# EAGLE design BackupPowerSupply (EAGLE 6.6.0)
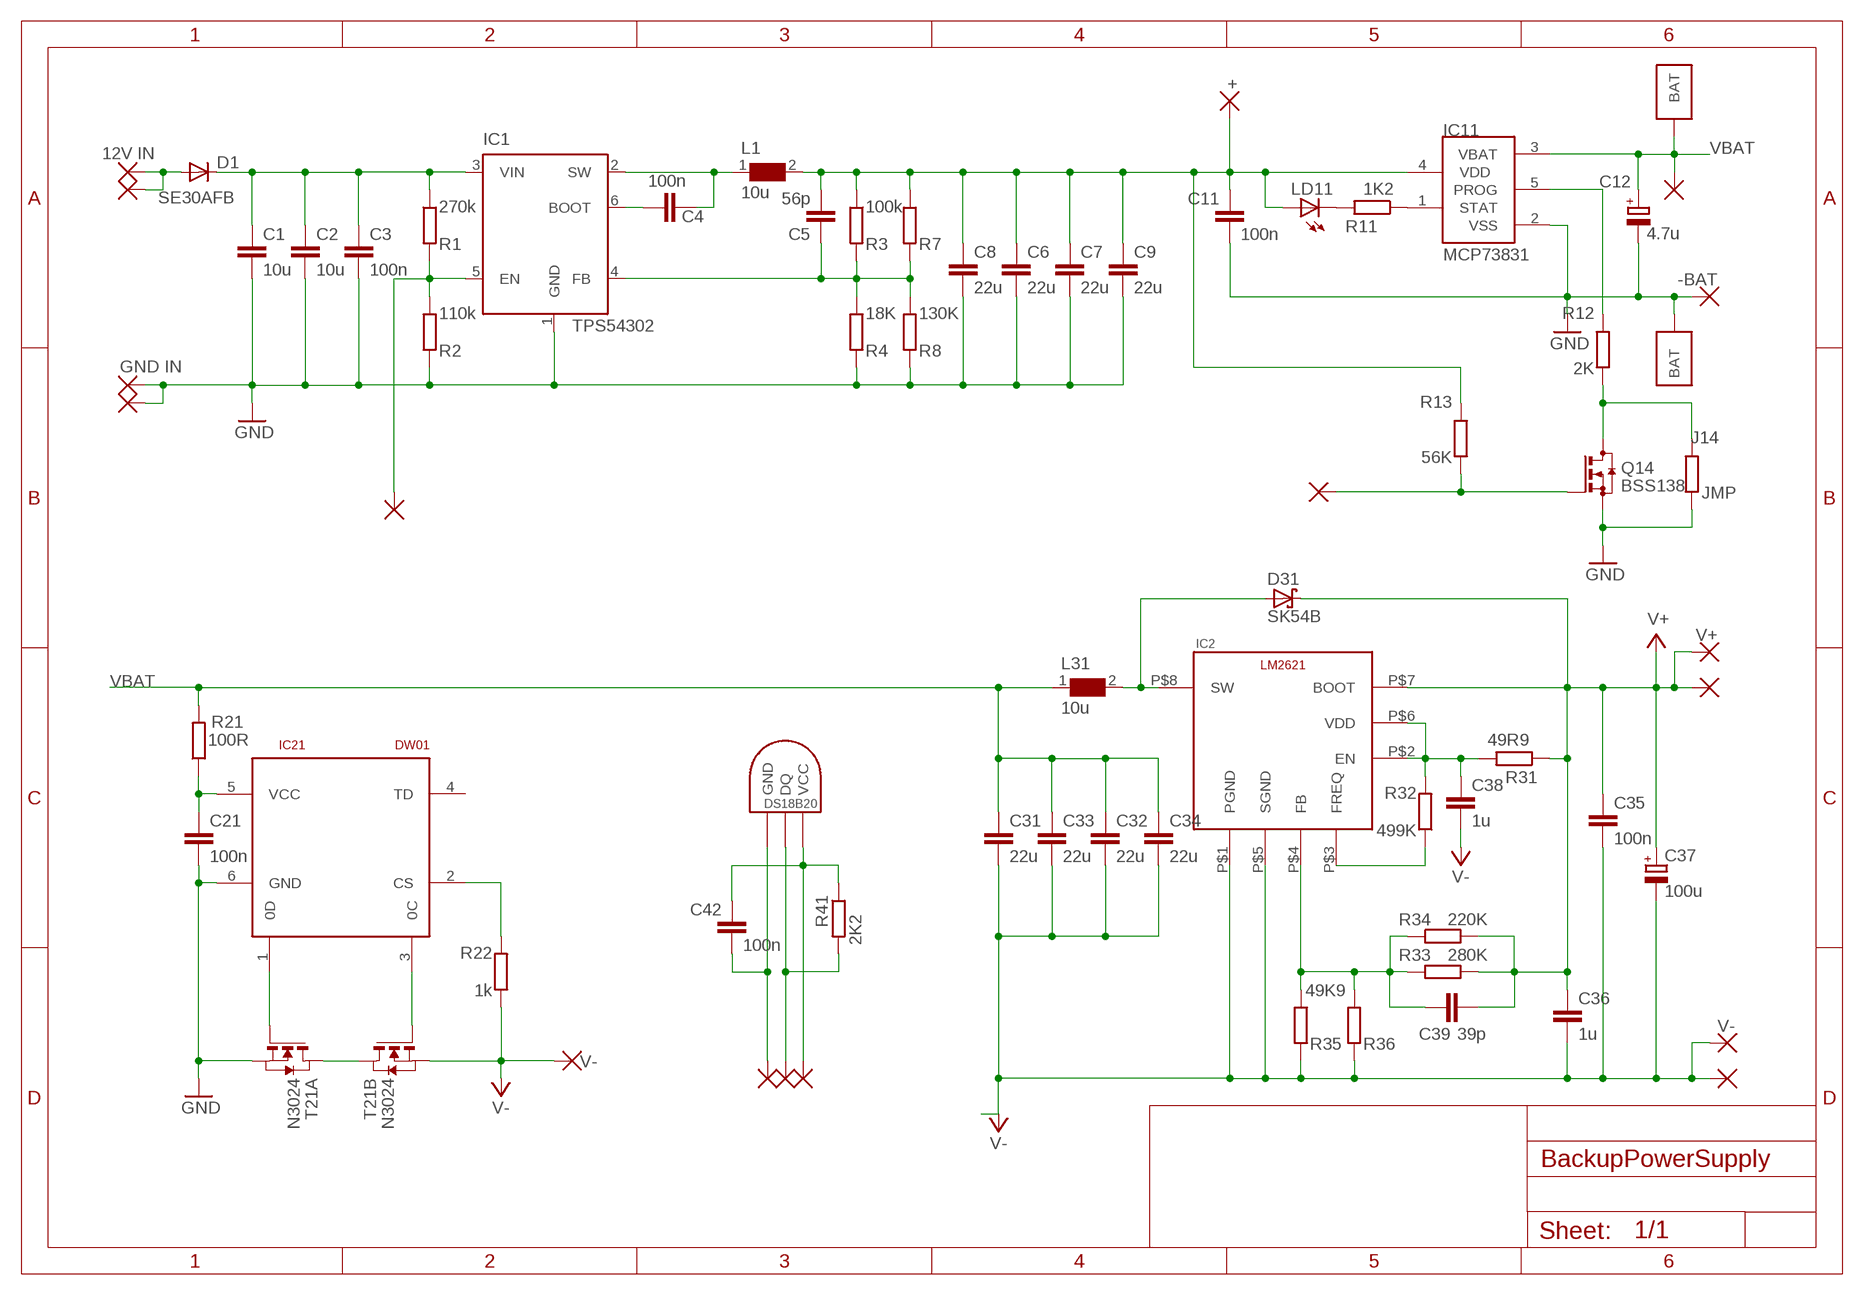
[diagram p0: schematic, sheet 1]

## Parts
C1  10u  C-EUC1206  [C1206]
C2  10u  C-EUC1206  [C1206]
C3  100n  C-EUC1206  [C1206]
C4  100n  C-EUC0805  [C0805]
C5  56p  C-EUC0805  [C0805]
C6  22u  C-EUC0805  [C0805]
C7  22u  C-EUC0805  [C0805]
C8  22u  C-EUC0805  [C0805]
C9  22u  C-EUC0805  [C0805]
C11  100n  C-EUC0805  [C0805]
C12  4.7u  CPOL-EUSMCA  [SMC_A]
C21  100n  C-EUC0805  [C0805]
C31  22u  C-EUC0805  [C0805]
C32  22u  C-EUC0805  [C0805]
C33  22u  C-EUC0805  [C0805]
C34  22u  C-EUC0805  [C0805]
C35  100n  C-EUC0805  [C0805]
C36  1u  C-EUC0805  [C0805]
C37  100u  CPOL-EUSMCB  [SMC_B]
C38  1u  C-EUC0805  [C0805]
C39  39p  C-EUC0805  [C0805]
C42  100n  C-EUC0603  [C0603]
D1  SE30AFB  CGRM4001-G  [SOD-123_MINI-SMA]
D31  SK54B  SCHOTTKY-DIODESMD  [SMB]
DS18B20  DS1820SOIC  [DS18B20_SOIC]
IC1  TPS54302  [TSOT23-6_DDC]
IC2  LM2621VSSOP8  [VSSOP8]
IC11  MCP73831  [SOT23-5L]
IC21  DW01  [SOT23-6]
J14  JMP  R-EU_R0201  [R0201]
L1  10u  WE-LQS_8040  [WE-LQS_8040]
L31  10u  WE-LQS_8040  [WE-LQS_8040]
LD11  LEDCHIPLED_0805  [CHIPLED_0805]
PAD1  +BAT  PAD  [PAD]
PAD2  -BAT  PAD  [PAD]
PAD3  12V IN  PAD  [PAD]
PAD4  GND IN  PAD  [PAD]
PAD5  V+  PAD  [PAD]
PAD6  V-  PAD  [PAD]
PAD7  +  PAD  [PAD]
PAD8  PAD  [PAD]
PAD9  V-  PAD  [PAD]
PAD11  V-  PAD  [PAD]
PAD12  V+  PAD  [PAD]
PAD13  +  PAD  [PAD]
PAD19  V-  PAD  [PAD]
PAD20  V-  PAD  [PAD]
PAD21  V-  PAD  [PAD]
PAD22  PAD  [PAD]
Q14  BSS138  BSS123  [SOT23]
R1  270k  R-EU_M0805  [M0805]
R2  110k  R-EU_M0805  [M0805]
R3  100k  R-EU_M0805  [M0805]
R4  18K  R-EU_M0805  [M0805]
R7  R-EU_M0805  [M0805]
R8  130K  R-EU_M0805  [M0805]
R11  1K2  R-EU_M0805  [M0805]
R12  2K  R-EU_M0805  [M0805]
R13  56K  R-EU_M0805  [M0805]
R21  100R  R-EU_M0805  [M0805]
R22  1k  R-EU_M0805  [M0805]
R31  49R9  R-EU_M0805  [M0805]
R32  499K  R-EU_M0805  [M0805]
R33  280K  R-EU_M0805  [M0805]
R34  220K  R-EU_M0805  [M0805]
R35  49K9  R-EU_M0805  [M0805]
R36  R-EU_M0805  [M0805]
R41  2K2  R-EU_R0603  [R0603]
T21  N3024  DMN3024LSD  [TSSOP-8]
U$1  BAT_A  [BAT_A]
U$2  BAT_A  [BAT_A]
U$3  PAD  [PAD]

## Nets
C6: C5.2 IC1.4(FB) R3.2 R4.1 R7.2 R8.1
FB2: C39.1 IC2.P$4(FB) R33.1 R34.1 R35.1 R36.1
GND: C1.1 C2.1 C3.1 C6.1 C7.1 C8.1 C9.1 C11.1 C12.- C21.1 IC1.1(GND) IC11.2(VSS) IC21.6(GND) J14.1 PAD2.P$1 PAD4.P$1 PAD8.P$1 Q14.2(S) R2.2 R4.2 R8.2 T21.2(A:S) T21.3(A:S) U$2.P$1(BAT) U$2.P$4(BAT)
N$1: C4.2 IC1.6(BOOT)
N$2: C42.1 DS18B20.GND PAD21.P$1
N$3: PAD7.P$1 Q14.1(G) R13.1
N$4: J14.2 Q14.3(D) R12.1
N$5: C5.1 C6.2 C7.2 C8.2 C9.2 C11.2 IC11.4(VDD) L1.2 LD11.A PAD13.P$1 R3.1 R7.1 R13.2
N$6: IC11.1(STAT) R11.1
N$7: IC1.5(EN) PAD22.P$1 R1.2 R2.1
N$8: D1.A PAD3.P$1 U$3.P$1
N$9: IC11.5(PROG) R12.2
N$10: IC21.3(0C) T21.5(B:G)
N$11: LD11.C R11.2
N$13: IC21.1(0D) T21.4(A:G)
N$14: C38.2 IC2.P$2(EN) IC2.P$6(VDD) R31.2 R32.2
N$15: IC2.P$3(FREQ) R32.1
N$17: T21.1(A:D) T21.8(B:D)
N$18: IC21.2(CS) R22.2
N$19: DS18B20.DQ PAD19.P$1 R41.2
N$20: C21.2 IC21.5(VCC) R21.1
N$21: C42.2 DS18B20.VCC PAD20.P$1 R41.1
OUT_DOWN: C4.1 IC1.2(SW) L1.1
V+: C35.2 C36.2 C37.+ C39.2 D31.C IC2.P$7(BOOT) PAD5.P$1 PAD12.P$1 R31.1 R33.2 R34.2
V-: C31.1 C32.1 C33.1 C34.1 C35.1 C36.1 C37.- C38.1 IC2.P$1(PGND) IC2.P$5(SGND) PAD6.P$1 PAD9.P$1 PAD11.P$1 R22.1 R35.2 R36.2 T21.6(B:S) T21.7(B:S)
VBAT: C12.+ C31.2 C32.2 C33.2 C34.2 IC11.3(VBAT) L31.1 PAD1.P$1 R21.2 U$1.P$1(BAT) U$1.P$4(BAT)
VIN_DOWN: C1.2 C2.2 C3.2 D1.C IC1.3(VIN) R1.1
VSW: D31.A IC2.P$8(SW) L31.2
Unconnected: IC21.4(TD)

## Library data of the parts
C1-C9 C11 C21 C31-C36 C38 C39 C42 = rcl:C-EU: CAPACITOR, European symbol
C12 C37 = rcl:CPOL-EU: POLARIZED CAPACITOR, European symbol
D1 = diode:CGRM400*-G: Molded plasitc,JEDEC SOD-123/Mini SMA Source: Comchip CGRM4001-G.pdf
D31 = diode:SCHOTTKY-DIODE: Schottky Diode
DS18B20 = Ava:DS1820: DS18B20 Programmable Resolution 1-Wire Digital Thermometer Description The DS18B20 digital thermometer provides 9-bit to 12-bit Celsius temperature measurements and has an alarm function with nonvolatile user-programmable upper and lower trigger points. The DS18B20 communicates over a 1-Wire® bus that by definition requires only one data line (and ground) for communication with a central microprocessor. It has an operating temperature range of -55°C to +125°C and is accurate to ±0.5°C over the range of -10°C to +85°C. In addition, the DS18B20 can derive power directly from the data line ("parasite power"), eliminating the need for an external power supply. Each DS18B20 has a unique 64-bit serial code, which allows multiple DS18B20s to function on the same 1-Wire bus. Thus, it is simple to use one microprocessor to control many DS18B20s distributed over a large area. Applications that can benefit from this feature include HVAC environmental controls, temperature monitoring systems inside buildings, equipment, or machinery, and process monitoring and control systems.
IC1 = tps54302:TPS54302: Single Voltage Detector Source: http://focus.ti.com/lit/ds/symlink/tps3803-01.pdf
IC2 = lm2621:LM2621
IC11 = microchip-update-2:MCP73831: Miniature Single-Cell, Fully Integrated Li-Ion, Li-Polymer Charge Management Controllers
IC21 = DW01:DW01: The DW01-P battery protection IC is designed to protect lithium-ion/polymer battery from damage or degrading the lifetime due to overcharge, overdischarge, and/or overcurrent for one-cell lithium-ion/polymer battery powered systems, such as cellular phones. Data sheet <http://goo.gl/4y108d> Dave.Calaway Eagle Library <https://goo.gl/Muy1Tr>
J14 R1-R4 R7 R8 R11-R13 R21 R22 R31-R36 R41 = rcl:R-EU_: RESISTOR, European symbol
L1 L31 = Wurth_Elektronik_Passive_rev15b:WE-LQS_8040: SMD Shielded Tiny Power Inductor -Tiny Power Inductor design -1.7 times more current in comparison with unshielded versions - Robust design& high durability -Low RDC -Magnetically shielded wth magneticc glue reducing buzz noise in ultra-low levels -Operating Temperature:-40°C to +125°C -- Intergrated DC/DC Converters --Switching controllers which required high effiiciency --Portable power(Smartphones,digital cameras,Tablets,etc) --Embedded laptops and PCs --Big sizes(5040,60xx,8040) used for shock-proof circiuts <http://katalog.we-online.de/media/images/eisos/IndLQS_pf2.jpg> Details see: http://katalog.we-online.de/en/pbs/WE-LQS Created by Dan Xu 2014-05-21 2014 (C) Würth Elektronik
LD11 = led:LED: LED OSRAM: - CHIPLED LG R971, LG N971, LY N971, LG Q971, LY Q971, LO R971, LY R971 LH N974, LH R974 LS Q976, LO Q976, LY Q976 LO Q996 - Hyper CHIPLED LW Q18S LB Q993, LB Q99A, LB R99A - SideLED LS A670, LO A670, LY A670, LG A670, LP A670 LB A673, LV A673, LT A673, LW A673 LH A674 LY A675 LS A676, LA A676, LO A676, LY A676, LW A676 LS A679, LY A679, LG A679 - Hyper Micro SIDELED® LS Y876, LA Y876, LO Y876, LY Y876 LT Y87S - SmartLED LW L88C, LW L88S LB L89C, LB L89S, LG L890 LS L89K, LO L89K, LY L89K LS L896, LA L896, LO L896, LY L896 - TOPLED LS T670, LO T670, LY T670, LG T670, LP T670 LSG T670, LSP T670, LSY T670, LOP T670, LYG T670 LG T671, LOG T671, LSG T671 LB T673, LV T673, LT T673, LW T673 LH T674 LS T676, LA T676, LO T676, LY T676, LB T676, LH T676, LSB T676, LW T676 LB T67C, LV T67C, LT T67C, LS T67K, LO T67K, LY T67K, LW E67C LS E67B, LA E67B, LO E67B, LY E67B, LB E67C, LV E67C, LT E67C LW T67C LS T679, LY T679, LG T679 LS T770, LO T770, LY T770, LG T770, LP T770 LB T773, LV T773, LT T773, LW T773 LH T774 LS E675, LA E675, LY E675, LS T675 LS T776, LA T776, LO T776, LY T776, LB T776 LHGB T686 LT T68C, LB T68C - Hyper Mini TOPLED® LB M676 - Mini TOPLED Santana® LG M470 LS M47K, LO M47K, LY M47K Source: http://www.osram.convergy.de LUXEON: - LUMILED® LXK2-PW12-R00, LXK2-PW12-S00, LXK2-PW14-U00, LXK2-PW14-V00 LXK2-PM12-R00, LXK2-PM12-S00, LXK2-PM14-U00 LXK2-PE12-Q00, LXK2-PE12-R00, LXK2-PE12-S00, LXK2-PE14-T00, LXK2-PE14-U00 LXK2-PB12-K00, LXK2-PB12-L00, LXK2-PB12-M00, LXK2-PB14-N00, LXK2-PB14-P00, LXK2-PB14-Q00 LXK2-PR12-L00, LXK2-PR12-M00, LXK2-PR14-Q00, LXK2-PR14-R00 LXK2-PD12-Q00, LXK2-PD12-R00, LXK2-PD12-S00 LXK2-PH12-R00, LXK2-PH12-S00 LXK2-PL12-P00, LXK2-PL12-Q00, LXK2-PL12-R00 Source: www.luxeon.com KINGBRIGHT: KA-3528ASYC Source: www.kingbright.com
PAD1-PAD9 PAD11-PAD13 PAD19-PAD22 U$3 = Battery_Clips:PAD
Q14 = transistor-small-signal:BSS123: N-CHANNEL MOS FET
T21 = FS8205A:DMN3024LSD: DUAL N-CHANNEL ENHANCEMENT MODE MOSFET data sheet <http://goo.gl/dRgboR> Dave.Calaway Eagle Library <https://goo.gl/Muy1Tr>
U$1 U$2 = Battery_Clips:BAT_A

## Board
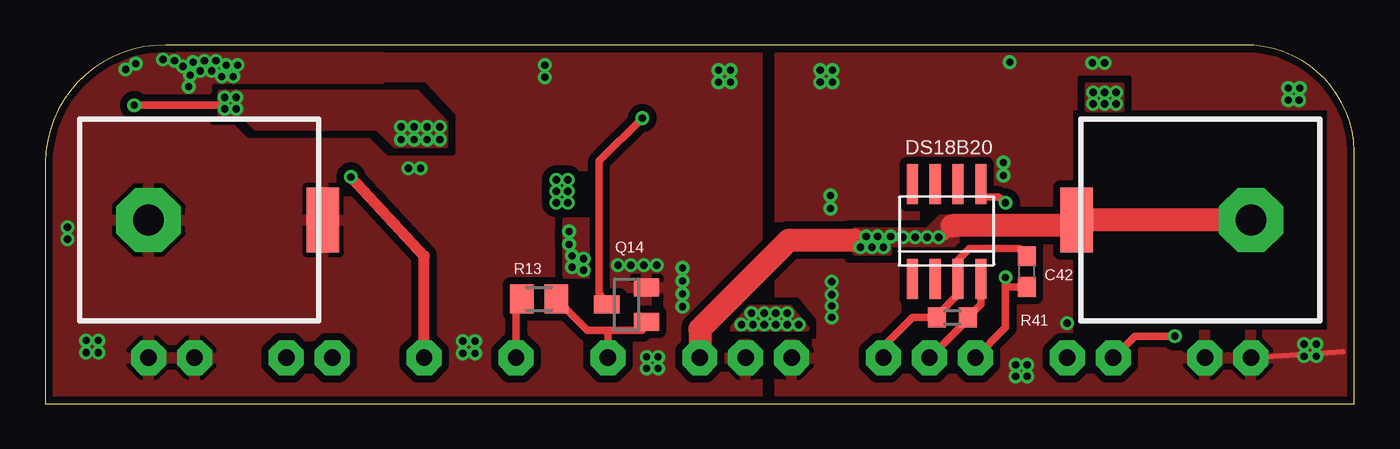
[diagram p1: board, top side]
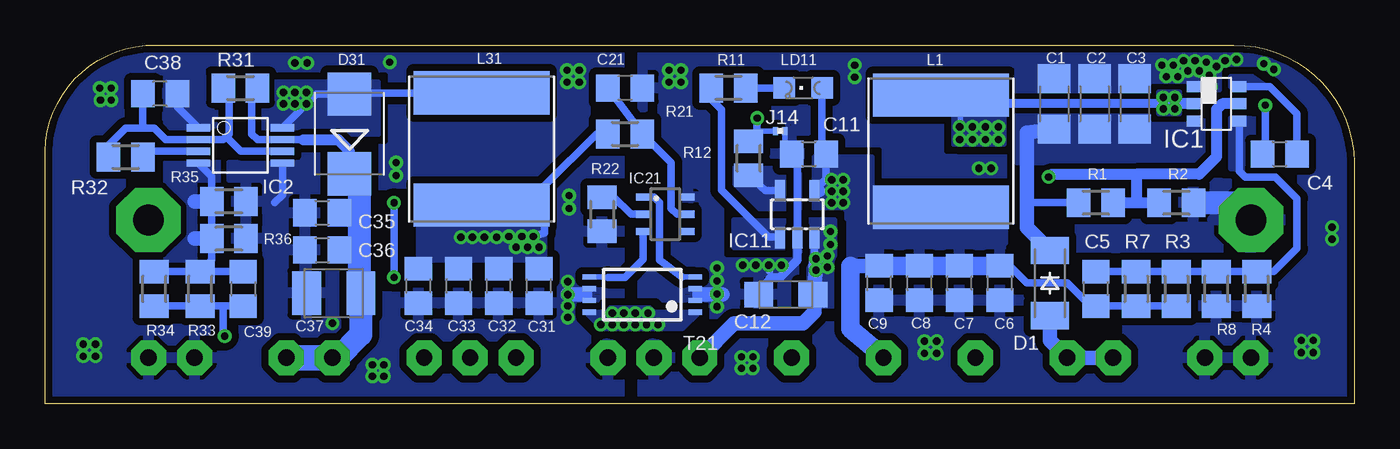
[diagram p2: board, bottom side, seen from below]

Size 72.39 x 19.83 mm. Coordinates in mm from the lower left corner, seen from the top.
Outline: 0,0 72.38,0 72.39,13.97 arc90 66.29,19.83 6.66,19.83 arc90 0,13.34 0,0
Copper layers (1*16): Top 0.0356mm / dielectric 1.5011mm / Bottom 0.0356mm
Design rules "oshpark-2layer_new": minimum track width 6mil, minimum drill 13mil, track to track 6mil, track to pad 6mil, pad to pad 6mil, via to via 6mil, smd to smd 6mil, copper to edge 15mil, drill to drill 6mil, minimum pad ring 7mil, minimum via ring 7mil, stop-mask expansion 2.5mil, vias tented up to drill 0mil, thermal gap 10mil

### Footprints (pad centres in the part's own frame; a part is rotated, then mirrored left to right if it is on the bottom)
C1206 = smd 1.6 x 1.8: 1 -1.4,0; 2 1.4,0
C0805 = smd 1.3 x 1.5: 1 -0.95,0; 2 0.95,0
SMC_A = smd 1.6 x 1.4: + -1.5,0; - 1.5,0
SMC_B = smd 1.6 x 2.4: + -1.5,0; - 1.5,0
C0603 = smd 1.1 x 1: 1 -0.85,0; 2 0.85,0
SOD-123_MINI-SMA = smd 1.5 x 2.1: A 1.8,0; C -1.8,0
SMB = smd 2.4 x 2.4: A 2.2,0; C -2.2,0
DS18B20_SOIC = smd 0.61 x 2.21: DQ 1.905,-2.616; GND 1.905,2.616; NC -1.905,-2.616; NC2 -0.635,-2.616; NC3 -1.905,2.616; NC4 -0.635,2.616; NC5 0.635,2.616; VCC 0.635,-2.616
TSOT23-6_DDC = smd 0.6 x 0.8: 1 -0.95,-1.25; 2 0,-1.25; 3 0.95,-1.25; 4 0.95,1.25; 5 0,1.25; 6 -0.95,1.25
VSSOP8 = smd 0.406 x 1.3: P$1 -0.975,-2.327; P$2 -0.325,-2.327; P$3 0.325,-2.327; P$4 0.975,-2.327; P$5 0.975,2.327; P$6 0.325,2.327; P$7 -0.325,2.327; P$8 -0.975,2.327
SOT23-5L = smd 0.55 x 1.2: 1 -0.95,-1.3; 2 0,-1.3; 3 0.95,-1.3; 4 0.95,1.3; 5 -0.95,1.3
SOT23-6 = smd 0.4 x 0.762: 1 -0.95,-1.245; 2 0,-1.245; 3 0.95,-1.245; 4 0.95,1.245; 5 0,1.245; 6 -0.95,1.245
R0201 = smd 0.28 x 0.43: 1 -0.255,0; 2 0.255,0
WE-LQS_8040 = smd 2.4 x 7.5: 1 -3.1,0; 2 3.1,0
CHIPLED_0805 = smd 1.2 x 1.2: A 0,-1.05; C 0,1.05
PAD = drill 0.9 pad 1.93 octagon: P$1 0,0
SOT23 = smd 1 x 1.4: 1 -0.95,-1.1; 2 0.95,-1.1; 3 0,1.1
M0805 = smd 1.3 x 1.6: 1 -0.95,0; 2 0.95,0
R0603 = smd 1 x 1.1: 1 -0.85,0; 2 0.85,0
TSSOP-8 = smd 0.3 x 0.75: 1 -0.975,-2.925; 2 -0.325,-2.925; 3 0.325,-2.925; 4 0.975,-2.925; 5 0.975,2.925; 6 0.325,2.925; 7 -0.325,2.925; 8 -0.975,2.925
BAT_A = drill 1.7 pad 3.556 octagon: P$1 0,0 | smd 1.8 x 3.6: P$4 -9.652,0

### Placement (x,y rotation side)
C1  16.59,16.59 270 bottom
C2  14.37,16.59 270 bottom
C3  12.14,16.59 270 bottom
C4  4.13,13.81 0 bottom
C5  14.29,6.35 90 bottom
C6  19.61,6.67 90 bottom
C7  21.83,6.67 90 bottom
C8  24.05,6.67 90 bottom
C9  26.27,6.67 90 bottom
C11  30.16,13.81 0 bottom
C12  31.43,6.03 180 bottom
C21  40.32,17.46 180 bottom
C31  45.09,6.51 90 bottom
C32  47.31,6.51 90 bottom
C33  49.53,6.51 90 bottom
C34  51.75,6.51 90 bottom
C35  57.07,10.56 0 bottom
C36  57.07,8.49 0 bottom
C37  56.44,6.11 180 bottom
C38  66.04,17.14 180 bottom
C39  61.44,6.35 270 bottom
C42  54.29,7.3 90 top
D1  16.83,6.67 270 bottom
D31  55.56,14.92 90 bottom
DS18B20  49.85,9.53 0 top
IC1  7.62,16.59 270 bottom
IC2  61.59,14.29 270 bottom
IC11  30.8,10.48 0 bottom
IC21  38.1,10.48 270 bottom
J14  31.75,15.08 180 bottom
L1  22.86,13.97 270 bottom
L31  48.26,14.09 90 bottom
LD11  30.48,17.46 90 bottom
PAD1  36.2,2.54 0 top
PAD2  38.73,2.54 0 top
PAD3  13.34,2.54 180 top
PAD4  5.71,2.54 0 top
PAD5  59.05,2.54 0 top
PAD6  66.67,2.54 0 top
PAD7  31.11,2.54 0 top
PAD8  8.26,2.54 0 top
PAD9  41.27,2.54 0 top
PAD11  64.14,2.54 0 top
PAD12  56.52,2.54 0 top
PAD13  26.04,2.54 0 top
PAD19  48.9,2.54 0 top
PAD20  46.35,2.54 0 top
PAD21  51.44,2.54 0 top
PAD22  20.95,2.54 0 top
Q14  32.15,5.48 90 top
R1  14.29,11.11 0 bottom
R2  9.84,11.11 0 bottom
R3  9.84,6.35 90 bottom
R4  5.4,6.35 270 bottom
R7  12.06,6.35 90 bottom
R8  7.62,6.35 270 bottom
R11  34.61,17.46 0 bottom
R12  33.5,13.57 270 bottom
R13  27.3,5.79 180 top
R21  40.32,14.92 180 bottom
R22  41.59,10.48 90 bottom
R31  61.59,17.46 180 bottom
R32  67.94,13.65 180 bottom
R33  63.82,6.35 270 bottom
R34  66.36,6.35 270 bottom
R35  62.23,11.19 0 bottom
R36  62.23,9.13 0 bottom
R41  50.16,4.76 0 top
T21  39.37,6.03 90 bottom
U$1  66.67,10.16 0 top
U$2  5.71,10.16 180 top
U$3  15.88,2.54 0 top

### Tracks (layer width: path | path; a pad name or v marks a point on that pad's centre or on a via)
C6
  Bottom 0.406: IC1.4 6.35,15.62 6.35,12.86 6.03,12.54 4.37,12.54 3.17,11.35 3.17,8.57 4.45,7.3 6.67,7.3 R4.1 R8.1 R3.2 R7.2 C5.2
  pour Bottom (isolate 0.305, rank 2, no thermals): 6.83,15.8 3.33,15.72 3.33,13.02 6.83,13.02
FB2
  Bottom 0.406: R33.1 C39.1 | R34.1 R33.1 | R33.1 63.18,7.94 R36.1 63.18,9.84 R35.1 63.18,12.57 IC2.P$4
  Bottom 0.813: 64.14,11.19 R35.1 | 64.14,9.13 R36.1
  pour Bottom (isolate 0.305, rank 2, no thermals): 62.55,13.34 65.72,13.34 65.72,7.94 64.14,7.94 64.14,12.38 62.55,12.38
GND  (via drill 0.4)
  Bottom 0.305: T21.2 T21.3 36.2,6.36 36.2,6.03 | 32.38,7.3 32.3,7.3 | J14.1 31.5,13.65 C11.1
  Bottom 0.406: IC11.2 30.8,13.5 C11.1
  Bottom 0.457: IC11.2 30.8,7.94 31.75,6.99 32.3,6.99 C12.-
  Bottom 0.813: 34.92,6.03 36.2,6.03
  Bottom 1.27: R2.2 6.67,11.11 U$2.P$1
  other vias: 2.26,2.82 2.26,3.49 20.08,13.02 20.76,13.02 27.62,18.73 27.62,18.06 37.23,18.45 37.23,17.78 35.24,6.79 37.9,18.45 37.9,17.78 2.94,3.49 2.94,2.82 23.1,3.45 23.77,3.45 23.1,2.78 23.77,2.78 1.23,9.09 1.23,9.76 35.24,7.5 35.24,6.07 35.24,5.36 7.94,17.54 8.02,18.18 8.57,18.41 9.21,18.41 9.45,18.97 7.62,18.65 10.4,18.1 8.81,18.97 8.18,18.89 9.76,18.1 10,18.73 10.64,18.73 7.14,18.97 6.51,19.05 5,18.81 4.45,18.49 31.67,7.66 32.38,7.66 33.1,7.66 33.81,7.66 33.26,2.58 33.89,2.58 33.26,1.94 33.89,1.94
  pour Bottom (isolate 0.406, rank 6): 0.32,19.37 39.37,19.37 39.37,0.32 0.32,0.32
  pour Top (isolate 0.406, rank 6): 0.32,19.37 39.37,19.37 39.37,0.32 0.32,0.32
  pour Bottom (isolate 0.305, rank 2, no thermals): 18.65,17.14 18.65,19.29 7.46,19.29 7.46,17.38 9.21,17.38 9.6,17.54 10.95,17.54 11.35,17.14
  pour Top (isolate 0.305, rank 2, no thermals): 18.57,17.3 18.57,19.45 7.38,19.45 7.38,17.3 9.13,17.3 9.53,17.7 10.87,17.7 11.27,17.3
N$1
  Bottom 0.406: C4.2 3.17,16.03 4.68,17.54 IC1.6
  pour Bottom (isolate 0.305, rank 2, no thermals): 6.83,17.54 6.83,18.1 5.64,18.1 4.84,17.54
N$2  (via drill 0.4)
  Top 0.406: v53.1,6.99 53.1,6.35 | 53.1,6.35 53.1,4.21 PAD21.P$1 | C42.1 53.12,6.45 53.1,6.35 | v53.1,11.11 52.7,11.43 51.75,11.43 DS18B20.GND
  Bottom 0.406: v53.1,11.11 v53.1,6.99
N$3
  Top 0.406: R13.1 30,4.05 30.96,4.05 | 30.96,4.05 33.01,4.05 Q14.1 | PAD7.P$1 31.11,3.89 30.96,4.05
N$4  (via drill 0.4)
  Top 0.406: Q14.3 30.64,6.12 30.64,13.41 v33.02,15.8
  Bottom 0.305: J14.2 32.94,15.08 arc-90 R12.1
  Bottom 0.406: v33.02,15.8 33.02,14.52 R12.1
N$5  (via drill 0.4)
  Top 0.406: R13.2 26.04,5.71 PAD13.P$1
  Bottom 0.305: IC11.4 29.82,11.78 29.82,11.75
  Bottom 0.406: IC11.4 29.21,12.41 C11.2 29.43,13.44 LD11.A | C6.2 19.05,7.62 18.1,6.67 15.88,6.67 14.61,5.4 C5.1 R7.1 R3.1
  Bottom 0.61: 29.82,11.75 29.53,11.75
  Bottom 0.813: 22.86,7.62 | C9.2 27.62,7.62 | 27.62,7.62 | 27.62,7.62 27.86,7.62
  Bottom 1.016: C6.2 22.86,7.62 | C7.2 C9.2 | 27.86,7.62 27.86,4.13 26.35,2.86 PAD13.P$1
  other vias: 28.89,12.38 28.89,11.75 28.89,11.11 28.26,11.11 28.26,11.75 28.26,12.38
  pour Bottom (isolate 0.406): 26.27,8.02 26.27,8.89 19.53,8.89 19.53,8.02
  pour Bottom (isolate 0.406, no thermals): 19.29,8.89 19.29,10.16 26.43,10.16 26.43,8.89
  pour Bottom (isolate 0.406, rank 2, no thermals): 29.84,10.79 29.84,13.65 26.67,13.65 26.67,8.26 27.62,8.26 27.62,7.3 27.94,7.3 27.94,10.16 28.57,10.79
N$6
  Bottom 0.406: R11.1 35.56,16.82 35,16.27 35,11.83 32.38,9.21 31.78,9.21 IC11.1
  pour Bottom (isolate 0.406, rank 2, no thermals): 31.43,10.16 34.29,10.16 34.29,8.65 31.43,8.65
N$7  (via drill 0.4)
  Top 0.61: PAD22.P$1 20.95,8.18 v16.91,12.54
  Bottom 0.61: IC1.5 7.3,16.59 7.62,16.27 7.62,13.65 8.57,12.7 12.06,12.7 | R1.2 12.06,11.11 | 12.06,11.11 R2.1 | 12.06,12.7 12.06,11.11 | v16.91,12.54 16.75,12.7 12.06,12.7
N$8
  Bottom 0.813: D1.A 16.83,3.49 U$3.P$1 PAD3.P$1
N$9
  Bottom 0.406: IC11.5 32.57,11.78 R12.2
  pour Bottom (isolate 0.406, no thermals): 31.43,10.79 34.61,10.79 34.61,13.02 31.43,13.02
N$10
  Bottom 0.305: T21.5 41.62,7.01 41.27,6.99
  Bottom 0.406: 41.27,6.99 40.32,6.99 39.34,7.96 IC21.3
N$11
  Bottom 0.406: R11.2 LD11.C
N$13
  Bottom 0.305: T21.4 37.17,7.01
  Bottom 0.406: IC21.1 38.73,11.43 38.42,11.11 38.42,7.94 37.17,7.01
N$14
  Bottom 0.406: 66.99,15.24 66.36,15.24 65.73,14.61 IC2.P$2 62.55,14.61 62.39,14.76 | 66.99,15.24 67.94,15.24 68.9,14.29 R32.2 | C38.2 66.99,15.24 | R31.2 62.23,17.15 62.23,14.92 62.39,14.76 | IC2.P$6 61.59,13.96 62.39,14.76
N$15
  Bottom 0.406: R32.1 66.69,13.96 IC2.P$3
N$17  (via drill 0.4)
  other vias: 40.4,4.37 40.4,5 39.77,5 39.05,5 39.77,4.37 39.13,4.37 38.5,4.37 41.04,4.37 41.04,5 41.67,4.37
  pour Bottom (no thermals): 36.2,5.08 38.73,5.08 38.97,5.32 41.12,5.32 41.35,5.08 42.55,5.08 41.59,4.13 37.15,4.13
  pour Top (isolate 0.305, no thermals): 38.97,5.32 41.2,5.32 42.15,4.13 37.94,4.13
N$18
  Bottom 0.406: IC21.2 40.01,10.48 40.95,11.43 R22.2
N$19
  Top 0.406: PAD19.P$1 51.02,4.66 R41.2 51.75,5.5 DS18B20.DQ
N$20
  Bottom 0.406: C21.2 R21.1 37.78,13.33 37.78,10.79 37.47,10.48 IC21.5
N$21
  Top 0.406: PAD20.P$1 46.35,3.17 47.94,4.76 R41.1 49.31,4.87 50.48,6.03 DS18B20.VCC 50.48,7.94 51.12,8.57 53.87,8.57 C42.2
OUT_DOWN  (via drill 0.4)
  Top 0.406: v4.92,16.51 9.92,16.51 v9.92,16.31
  Bottom 0.305: L1.1 21.59,17.39 v21.83,15.32
  Bottom 0.406: v4.92,16.51 4.92,14.05 C4.1
  Bottom 0.508: 10.08,16.59 20.64,16.59
  Bottom 0.61: IC1.2 9.84,16.59 v9.92,16.95
  other vias: 19.68,15.32 10.56,16.31 10.56,16.95 19.68,14.61 20.4,14.61 20.4,15.32 21.11,15.32 21.11,14.61 21.83,14.61
  pour Top: 9.68,17.22 9.68,15.95 10.95,15.95 11.67,15.24 18.41,15.24 19.37,14.29 22.15,14.29 22.15,15.56 20.56,17.22
  pour Bottom (isolate 0.305, no thermals): 19.37,15.88 22.15,15.88 22.15,14.37 19.37,14.37
  pour Bottom: 9.68,17.22 9.68,16.03 10.79,16.03 10.79,17.22
V+  (via drill 0.4)
  Top 0.406: v62.47,3.73 60.25,3.73 PAD5.P$1
  Bottom 0.406: 62.55,5.4 R33.2 R34.2 | 62.55,5.4 C39.2 | v62.47,3.73 62.55,3.81 62.55,5.4 | R31.1 60.96,17.46 60.96,14.92 60.65,14.61 IC2.P$7 58.43,14.61 58.1,14.61 | 55.56,13.97 D31.C
  Bottom 0.61: 55.56,13.97 56.2,14.61 56.21,14.61 58.1,14.61
  Bottom 1.27: 54.85,6.1 C37.+ | C37.+ 54.94,3.8 56.2,2.54 PAD12.P$1 | C37.+ 55.01,6.18 55.01,8.57 | 55.01,8.57 55.01,10.48 | 55.01,10.48 55.01,12.14 55.56,12.7 D31.C | C35.2 56.04,10.48 55.01,10.48 | C36.2 56.04,8.57 55.01,8.57
  Bottom 1.422: PAD5.P$1 PAD12.P$1
V-  (via drill 0.4)
  Top 0.305: 71.75,2.86 PAD6.P$1
  Bottom 0.305: T21.7 T21.6 42.55,6.36 42.55,6.03
  Bottom 0.406: IC2.P$1 65.09,16.43 C38.1 | IC2.P$5 59.27,11.53 59.69,11.11
  Bottom 0.813: v43.5,6.03 42.55,6.03
  other vias: 53.34,18.89 69.33,16.79 68.74,16.79 68.74,17.46 70.29,3.29 69.61,3.29 69.61,2.62 70.29,2.62 43.54,18.45 43.42,10.79 43.42,11.51 53.66,2.14 54.29,2.14 54.29,1.51 53.66,1.51 52.98,13.34 42.86,18.45 42.86,17.78 43.54,17.78 57.9,18.85 58.58,18.85 43.5,5.4 56.52,4.45 52.98,12.62 43.5,6.75 43.5,4.76 69.37,17.46
  pour Bottom (isolate 0.406, rank 6): 40.64,19.37 72.07,19.37 72.07,0.32 40.64,0.32
  pour Top (isolate 0.406, rank 6): 40.64,19.37 56.52,19.37 56.52,0.32 40.64,0.32
  pour Top (isolate 0.406): 55.56,3.81 72.07,3.81 72.07,0.32 55.24,0.32 55.24,4.13
  pour Top (isolate 0.406, rank 3): 55.24,19.37 72.07,19.37 72.07,16.51 55.24,16.51
  pour Top: 71.12,18.41 71.12,2.54 72.07,2.54 72.07,18.41
  pour Bottom (isolate 0.305, no thermals): 57.78,13.34 62.23,13.34 62.23,12.38 57.78,12.38
  pour Bottom (isolate 0.305, no thermals): 63.18,15.24 65.72,15.24 65.72,18.41 63.18,18.41
VBAT  (via drill 0.4)
  Top 0.305: v49.41,9.21 49.85,9.21 50.16,9.53 50.16,9.84
  Top 1.27: 44.77,9.05 41.12,9.05 36.2,4.13 PAD1.P$1 | U$1.P$1 U$1.P$4 56.71,9.84 50.16,9.84
  Bottom 0.406: v45.4,9.25 44.77,9.45 44.77,12.06 41.91,14.92 R21.2 | IC11.3 29.85,8.1 v29.77,8.02
  Bottom 0.813: 29.84,6.04 29.84,6.02 C12.+ | 29.84,6.04 C12.+ | 29.84,6.04 v29.77,8.02 | PAD1.P$1 34.29,4.45 30.48,4.45 29.84,5.08 29.84,5.95 C12.+
  other vias: 45.09,8.65 46.75,9.25 47.43,9.21 48.1,9.21 48.78,9.21 46.04,9.25 45.72,8.65 46.35,8.65 29.13,8.18 29.13,7.54 29.77,7.38 28.97,8.81 28.97,9.53
  pour Top (isolate 0.406): 44.77,9.6 48.82,9.6 49.53,10.32 50.4,10.32 50.4,8.81 46.67,8.81 46.67,8.33 44.77,8.33
  pour Bottom (isolate 0.305, no thermals): 44.77,10.16 51.75,10.16 51.75,7.94 44.77,7.94
  pour Bottom (isolate 0.406, no thermals): 30.16,10.16 30.16,5.4 28.73,5.4 28.73,10.16
  pour Top (isolate 0.305): 30.16,7.06 30.16,10.16 28.73,10.16 28.73,7.06
VIN_DOWN
  Bottom 0.406: R1.1 18.1,11.11
  Bottom 0.813: C1.2 18.1,15 18.1,11.11 18.1,9.74 D1.C
  pour Bottom (isolate 0.305, rank 2, no thermals): 18.65,16.19 11.43,16.27 10.79,15.64 7.62,15.64 7.62,13.34 18.65,13.34
VSW  (via drill 0.4)
  Bottom 0.406: IC2.P$8 57.41,17.12 D31.A 55.5,17.19 L31.2
  other vias: 59.21,16.59 58.58,16.59 57.94,16.59 57.94,17.22 58.58,17.22 59.21,17.22
  pour Bottom (isolate 0.305, rank 2, no thermals): 49.21,17.78 49.21,17.46 49.53,17.14
  pour Bottom (isolate 0.305, no thermals): 60.33,14.92 60.33,17.78 53.98,17.78 53.98,14.92
  pour Top (rank 2, no thermals): 59.53,16.27 59.53,17.62 57.63,17.62 57.63,16.27

### Text on the board
tDocu: + | 18650 / battery / li-ion | -
bDocu: - | - | - | + | OUT | - | IN | EN | + | /CHARG | -BAT+ | temp | + | +